# Altium schematic sheet Top.SchDoc: Top
size A4; Date: Not used; ApprovedBy: Not used; CheckedBy: Not used; Author: Not used; CompanyName: STMicroelectronics; DrawnBy: Not used; Engineer: Not used; Organization: Not used; Address1: Not used; Address2: Not used; Address3: Not used; Address4: Not used; DocumentNumber: Not used; Revision: Not used; SheetNumber: 2; SheetTotal: 2; CurrentTime: Not used; CurrentDate: Not used; Time: Not used; DocumentFullPathAndName: Not used; DocumentName: Not used; ModifiedDate: Not used; ImagePath: Not used; ProjectName: Not used; Application_BuildNumber: Not used
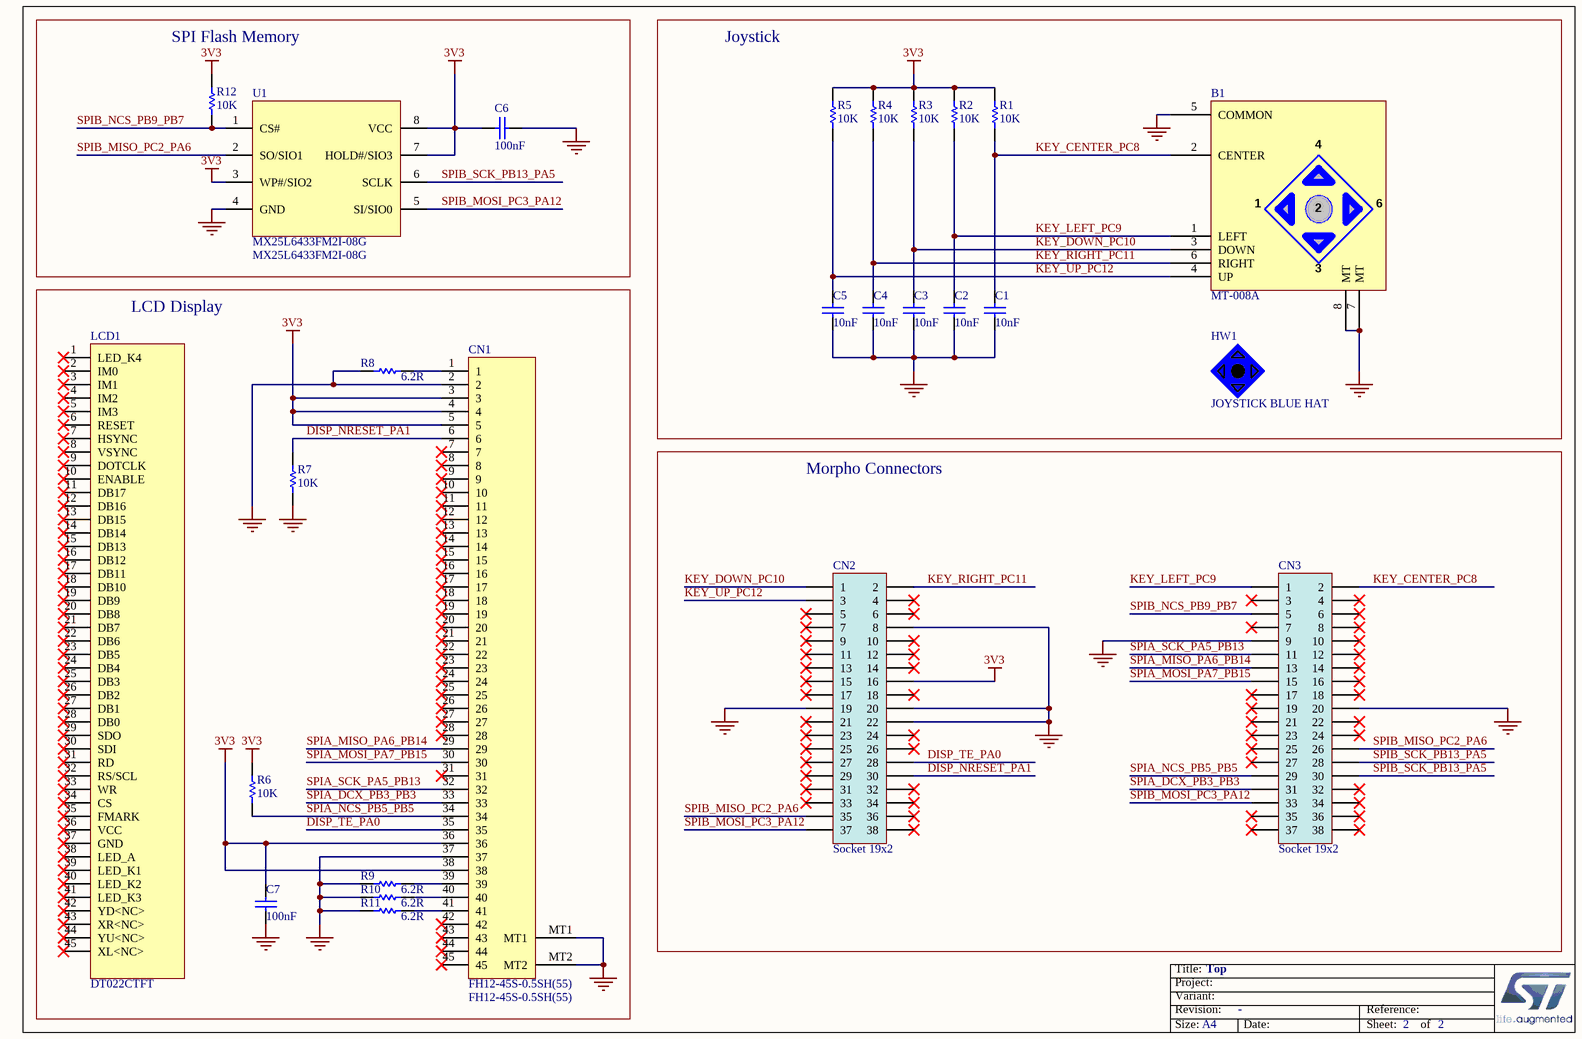
[diagram p0: Top.SchDoc]

## Parts
B1  value MT-008A  [SWI_XIEJIA_MT-008A_6P]  (hidden comment: Joystick MT-008A_M)
C1  value 10nF  [C0603]  (hidden comment: Capacitor)
C2  value 10nF  [C0603]  (hidden comment: Capacitor)
C3  value 10nF  [C0603]  (hidden comment: Capacitor)
C4  value 10nF  [C0603]  (hidden comment: Capacitor)
C5  value 10nF  [C0603]  (hidden comment: Capacitor)
C6  value 100nF  [C0603]  (hidden comment: Capacitor)
C7  value 100nF  [C0603]  (hidden comment: Capacitor)
CN1  FH12-45S-0.5SH(55)  [CON_HRS_FH12-45S-05SH]
CN2  Socket 19x2  [CON_SAMTEC_SSW-119-01-X-D]
CN3  Socket 19x2  [CON_SAMTEC_SSW-119-01-X-D]
HW1  value JOYSTICK BLUE HAT  (hidden comment: JOYSTICK_BLUE_HAT)  (mechanical)
LCD1  DT022CTFT  [LCD_DISPLAYTECH_DT022CTFT_45P_P050]
R1  value 10K  [R0603]  (hidden comment: Resistor)
R2  value 10K  [R0603]  (hidden comment: Resistor)
R3  value 10K  [R0603]  (hidden comment: Resistor)
R4  value 10K  [R0603]  (hidden comment: Resistor)
R5  value 10K  [R0603]  (hidden comment: Resistor)
R6  value 10K  [R0603]  (hidden comment: Resistor)
R7  value 10K  [R0603]  (hidden comment: Resistor)
R8  value 6.2R  [R1206_H0P55]  (hidden comment: Resistor)
R9  value 6.2R  [R1206_H0P55]  (hidden comment: Resistor)
R10  value 6.2R  [R1206_H0P55]  (hidden comment: Resistor)
R11  value 6.2R  [R1206_H0P55]  (hidden comment: Resistor)
R12  value 10K  [R0603]  (hidden comment: Resistor)
U1  MX25L6433FM2I-08G  [ICC_SOP8_5P23X5P28_P127]

## Blocks framed on the sheet
SPI Flash Memory: C6 R12 U1
Joystick: B1 C1-C5 HW1 R1-R5
LCD Display: C7 CN1 LCD1 R6-R11
Morpho Connectors: CN2 CN3

## Nets
3V3: C6.1 C7.2 CN1.3 CN1.4 CN1.5 CN1.36 CN1.38 CN2.16 R1.1 R2.2 R3.2 R4.2 R5.2 R6.2 R12.1 U1.3(WP#/SIO2) U1.7(HOLD#/SIO3) U1.8(VCC)
GND: B1.5(COMMON) B1.7(MT) B1.8(MT) C1.1 C2.1 C3.1 C4.1 C5.1 C6.2 C7.1 CN1.2 CN1.37 CN1.MT1 CN1.MT2 CN2.8 CN2.19 CN2.20 CN2.22 CN3.9 CN3.20 R7.1 R8.1 R9.1 R10.1 R11.1 U1.4(GND)
DISP_NRESET_PA1: CN1.6 CN2.30 R7.2
DISP_TE_PA0: CN1.35 CN2.28
KEY_CENTER_PC8: B1.2(CENTER) C1.2 CN3.2 R1.2
KEY_DOWN_PC10: B1.3(DOWN) C3.2 CN2.1 R3.1
KEY_LEFT_PC9: B1.1(LEFT) C2.2 CN3.1 R2.1
KEY_RIGHT_PC11: B1.6(RIGHT) C4.2 CN2.2 R4.1
KEY_UP_PC12: B1.4(UP) C5.2 CN2.3 R5.1
SPIA_DCX_PB3_PB3: CN1.33 CN3.31
SPIA_MISO_PA6_PB14: CN1.29 CN3.13
SPIA_MOSI_PA7_PB15: CN1.30 CN3.15
SPIA_NCS_PB5_PB5: CN1.34 CN3.29 R6.1
SPIA_SCK_PA5_PB13: CN1.32 CN3.11
SPIB_MISO_PC2_PA6: CN2.35 CN3.26 U1.2(SO/SIO1)
SPIB_MOSI_PC3_PA12: CN2.37 CN3.33 U1.5(SI/SIO0)
SPIB_NCS_PB9_PB7: CN3.5 R12.2 U1.1(CS#)
SPIB_SCK_PB13_PA5: CN3.28 CN3.30 U1.6(SCLK)
NetCN1_1: CN1.1 R8.2
NetCN1_39: CN1.39 R9.2
NetCN1_40: CN1.40 R10.2
NetCN1_41: CN1.41 R11.2

Not connected (* = marked no-connect by the designer): CN1 7* 8* 9* 10* 11* 12* 13* 14* 15* 16* 17* 18* 19* 20* 21* 22* 23* 24* 25* 26* 27* 28* 31* 42* 43* 44* 45*; CN2 4* 5* 6* 7* 9* 10* 11* 12* 13* 14* 15* 17* 18* 21* 23* 24* 25* 26* 27* 29* 31* 32* 33* 34* 36* 38*; CN3 3* 4* 6* 7* 8* 10* 12* 14* 16* 17* 18* 19* 21* 22* 23* 24* 25* 27* 32* 34* 35* 36* 37* 38*; LCD1 1(LED_K4)* 2(IM0)* 3(IM1)* 4(IM2)* 5(IM3)* 6(RESET)* 7(HSYNC)* 8(VSYNC)* 9(DOTCLK)* 10(ENABLE)* 11(DB17)* 12(DB16)* 13(DB15)* 14(DB14)* 15(DB13)* 16(DB12)* 17(DB11)* 18(DB10)* 19(DB9)* 20(DB8)* 21(DB7)* 22(DB6)* 23(DB5)* 24(DB4)* 25(DB3)* 26(DB2)* 27(DB1)* 28(DB0)* 29(SDO)* 30(SDI)* 31(RD)* 32(RS/SCL)* 33(WR)* 34(CS)* 35(FMARK)* 36(VCC)* 37(GND)* 38(LED_A)* 39(LED_K1)* 40(LED_K2)* 41(LED_K3)* 42(YD<NC>)* 43(XR<NC>)* 44(YU<NC>)* 45(XL<NC>)*

## Notes on the sheet
- Title:
- Project:
- Size:
- Revision:
- Variant:
- A4
- -
- Date:
- Reference:
- Sheet:
- of

## Library data of the parts
B1 = MCD-00132: Joystick, 4 dir, 1 OK; Part_Type: Misc; Manufacturer: XIEJIA ELECTRONICS; BMS_Part_Number: 9180124; Provided_By: SUBCO; Internal_Part_Number: MCD-00132; Status: Released; Manufacturer_Part_Number: MT-008A; ComponentLink1Description: Datasheet; ComponentLink1URL: http://tunmcdsvn.tun.st.com/Component_Datasheet_Library/Trunk/Misc/Xieja electronics_MT-008A; ECCN_US: n/a; ECCN_EU: n/a
C1-C5 = MCD-01098: Capacitor,10nF,100V,X7R,10%,0603; Manufacturer_Part_Number: CC0603KRX7R0BB103; Manufacturer: YAGEO; ECCN_US: EAR99; ECCN_EU: NEC; Provided_By: SUBCO; Internal_Part_Number: MCD-01098; Status: Checked; Part_Type: Capacitor; Alternate_Manufacturer_Part_Number: N/A; Alternate_Manufacturer: N/A; Package: C0603; ComponentLink1Description: Datasheet; ComponentLink1URL: http://tunmcdsvn.tun.st.com/Component_Datasheet_Library/Trunk/Capacitors/Yageo_Multilayer_Capacitor_NPO_X7R_100V_to_630V_0.47pF%20to%202.2uF/Yageo_Multilayer_Capacitor_NPO_X7R_100V_to_630V_0.47pF%20to%202.2uF.pdf; Order_Code_Digikey: 311-1788-1-ND; Order_Code_Farnell: 1284119; Order_Code_RS: N/A; BMS_Part_Number: N/A
C6 C7 = MCD-00237: Capacitor, MLCC, 100nF, 6V3, X5R, 10%, 0603, T=0,8mm; Manufacturer_Part_Number: CC0603KRX5R5BB104; Manufacturer: YAGEO; ECCN_US: EAR99; ECCN_EU: NEC; Provided_By: SUBCO; Internal_Part_Number: MCD-00237; Status: Released; Part_Type: Capacitor; Package: C0603; ComponentLink1Description: Datasheet; ComponentLink1URL: http://tunmcdsvn.tun.st.com/Component_Datasheet_Library/Trunk/Capacitors/Yageo_Multilayer_capacitor_X5R_series_100pF_to_100uF
CN1 = MCD-01980: 45 pins P 0.5 surface mount connector; Manufacturer: HIROSE; Order_Code_RS: 772-7027; ECCN_US: EAR99; ECCN_EU: NEC; Provided_By: SUBCO; Internal_Part_Number: MCD-01980; Value: FH12-45S-0.5SH(55); Status: Checked; Part_Type: Connector; Manufacturer_Part_Number: FH12-45S-0.5SH(55); Alternate_Manufacturer_Part_Number: N/A; Alternate_Manufacturer: N/A; ComponentLink1Description: Datasheet; ComponentLink1URL: http://tunmcdsvn.tun.st.com/Component_Datasheet_Library/Trunk/Connectors/Hirose_FH12-45S-05SH/Hirose_FH12-45S-0.5SH(55).pdf; Order_Code_Digikey: HFJ145CT-ND; Order_Code_Farnell: 2427723; BMS_Part_Number: N/A
CN2 CN3 = MCD-01845: Socket, 19x2, 2.54mm, VR, TH, Height 8.51mm/2.64mm; Part_Type: Connector; Manufacturer_Part_Number: SSW-119-01-x-D; Manufacturer: SAMTEC; Provided_By: SUBCO; Internal_Part_Number: MCD-01845; Value: Socket 19x2; Status: Checked; ComponentLink1Description: Datasheet; ComponentLink1URL: http://tunmcdsvn.tun.st.com/Component_Datasheet_Library/Trunk/Connectors/Samtec_SSW-SSQ-series; ECCN_US: n/a; ECCN_EU: n/a
HW1 = MCD-01337: Joystick Blue Hat; Part_Type: Mechanical; Manufacturer_Part_Number: PB-504; Manufacturer: JIUBABA; Provided_By: SUBCO; Internal_Part_Number: MCD-01337; Status: Released; ComponentLink1Description: Datasheet; ComponentLink1URL: http://tunmcdsvn.tun.st.com/Component_Datasheet_Library/Trunk/Mechanical/JIUBABA_JOYSTICK_HAT_PB-504; ECCN_US: n/a; ECCN_EU: n/a
LCD1 = MCD-01982: 240x320 2.2inch display; Manufacturer: DISPLAYTECH; Order_Code_RS: 182-5796; ECCN_US: EAR99; ECCN_EU: NEC; Provided_By: SUBCO; Internal_Part_Number: MCD-01982; Status: Checked; Part_Type: Display; Manufacturer_Part_Number: DT022CTFT; ComponentLink1Description: Datasheet; ComponentLink1URL: http://tunmcdsvn.tun.st.com/Component_Datasheet_Library/Trunk/Display/Displaytech_LCD_DT022CTFT/DisplayTech_2.2_240x320.pdf
R1-R7 R12 = MCD-00220: Resistor,10K,0603,1%,1/10W; Manufacturer_Part_Number: RC0603FR-0710KL; Manufacturer: YAGEO; ECCN_US: EAR99; ECCN_EU: NEC; Provided_By: SUBCO; Internal_Part_Number: MCD-00220; Status: Released; Part_Type: Resistor; Package: R0603; ComponentLink1Description: Datasheet; ComponentLink1URL: http://tunmcdsvn.tun.st.com/Component_Datasheet_Library/Trunk/Resistors/Yageo_Resistor_RC0603-series
R8-R11 = MCD-02101: Resistor,6.2R,1206,1%,0.5W; Manufacturer_Part_Number: ERJ8BQF6R2V; Manufacturer: PANASONIC; Order_Code_RS: 721-6019; ECCN_US: EAR99; ECCN_EU: NEC; Provided_By: SUBCO; Internal_Part_Number: MCD-02101; Status: Checked; Part_Type: Resistor; Alternate_Manufacturer_Part_Number: N/A; Alternate_Manufacturer: N/A; Package: 1206; ComponentLink1Description: Datasheet; ComponentLink1URL: http://tunmcdsvn.tun.st.com/Component_Datasheet_Library/Trunk/Resistors/PANASONIC_Resistor_6.2R_1%_ERJ8BQF6R2V/; Order_Code_Digikey: P17619CT-ND; Order_Code_Farnell: 1892997; BMS_Part_Number: N/A
U1 = MCD-01981: Part_Type: IC; Manufacturer: MACRONIX; Order_Code_RS: 170-3096; ECCN_US: 3A991.B.1.A; ECCN_EU: NEC; Provided_By: SUBCO; Internal_Part_Number: MCD-01981; Value: MX25L6433FM2I-08G; Status: Checked; Manufacturer_Part_Number: MX25L6433FM2I-08G; Alternate_Manufacturer_Part_Number: N/A; Alternate_Manufacturer: N/A; Package: SOP8 200; ComponentLink1Description: Datasheet; ComponentLink1URL: http://tunmcdsvn.tun.st.com/Component_Datasheet_Library/Trunk/IC/Macronix_NOR_QSPI_MX25L6433F/; Order_Code_Digikey: MX25L6433FM2I-08G-ND; Order_Code_Farnell: 3129181; BMS_Part_Number: N/A